# Altium schematic sheet IDC.SchDoc
size A3; DocumentNumber: 9; SheetNumber: 9; SheetTotal: 9
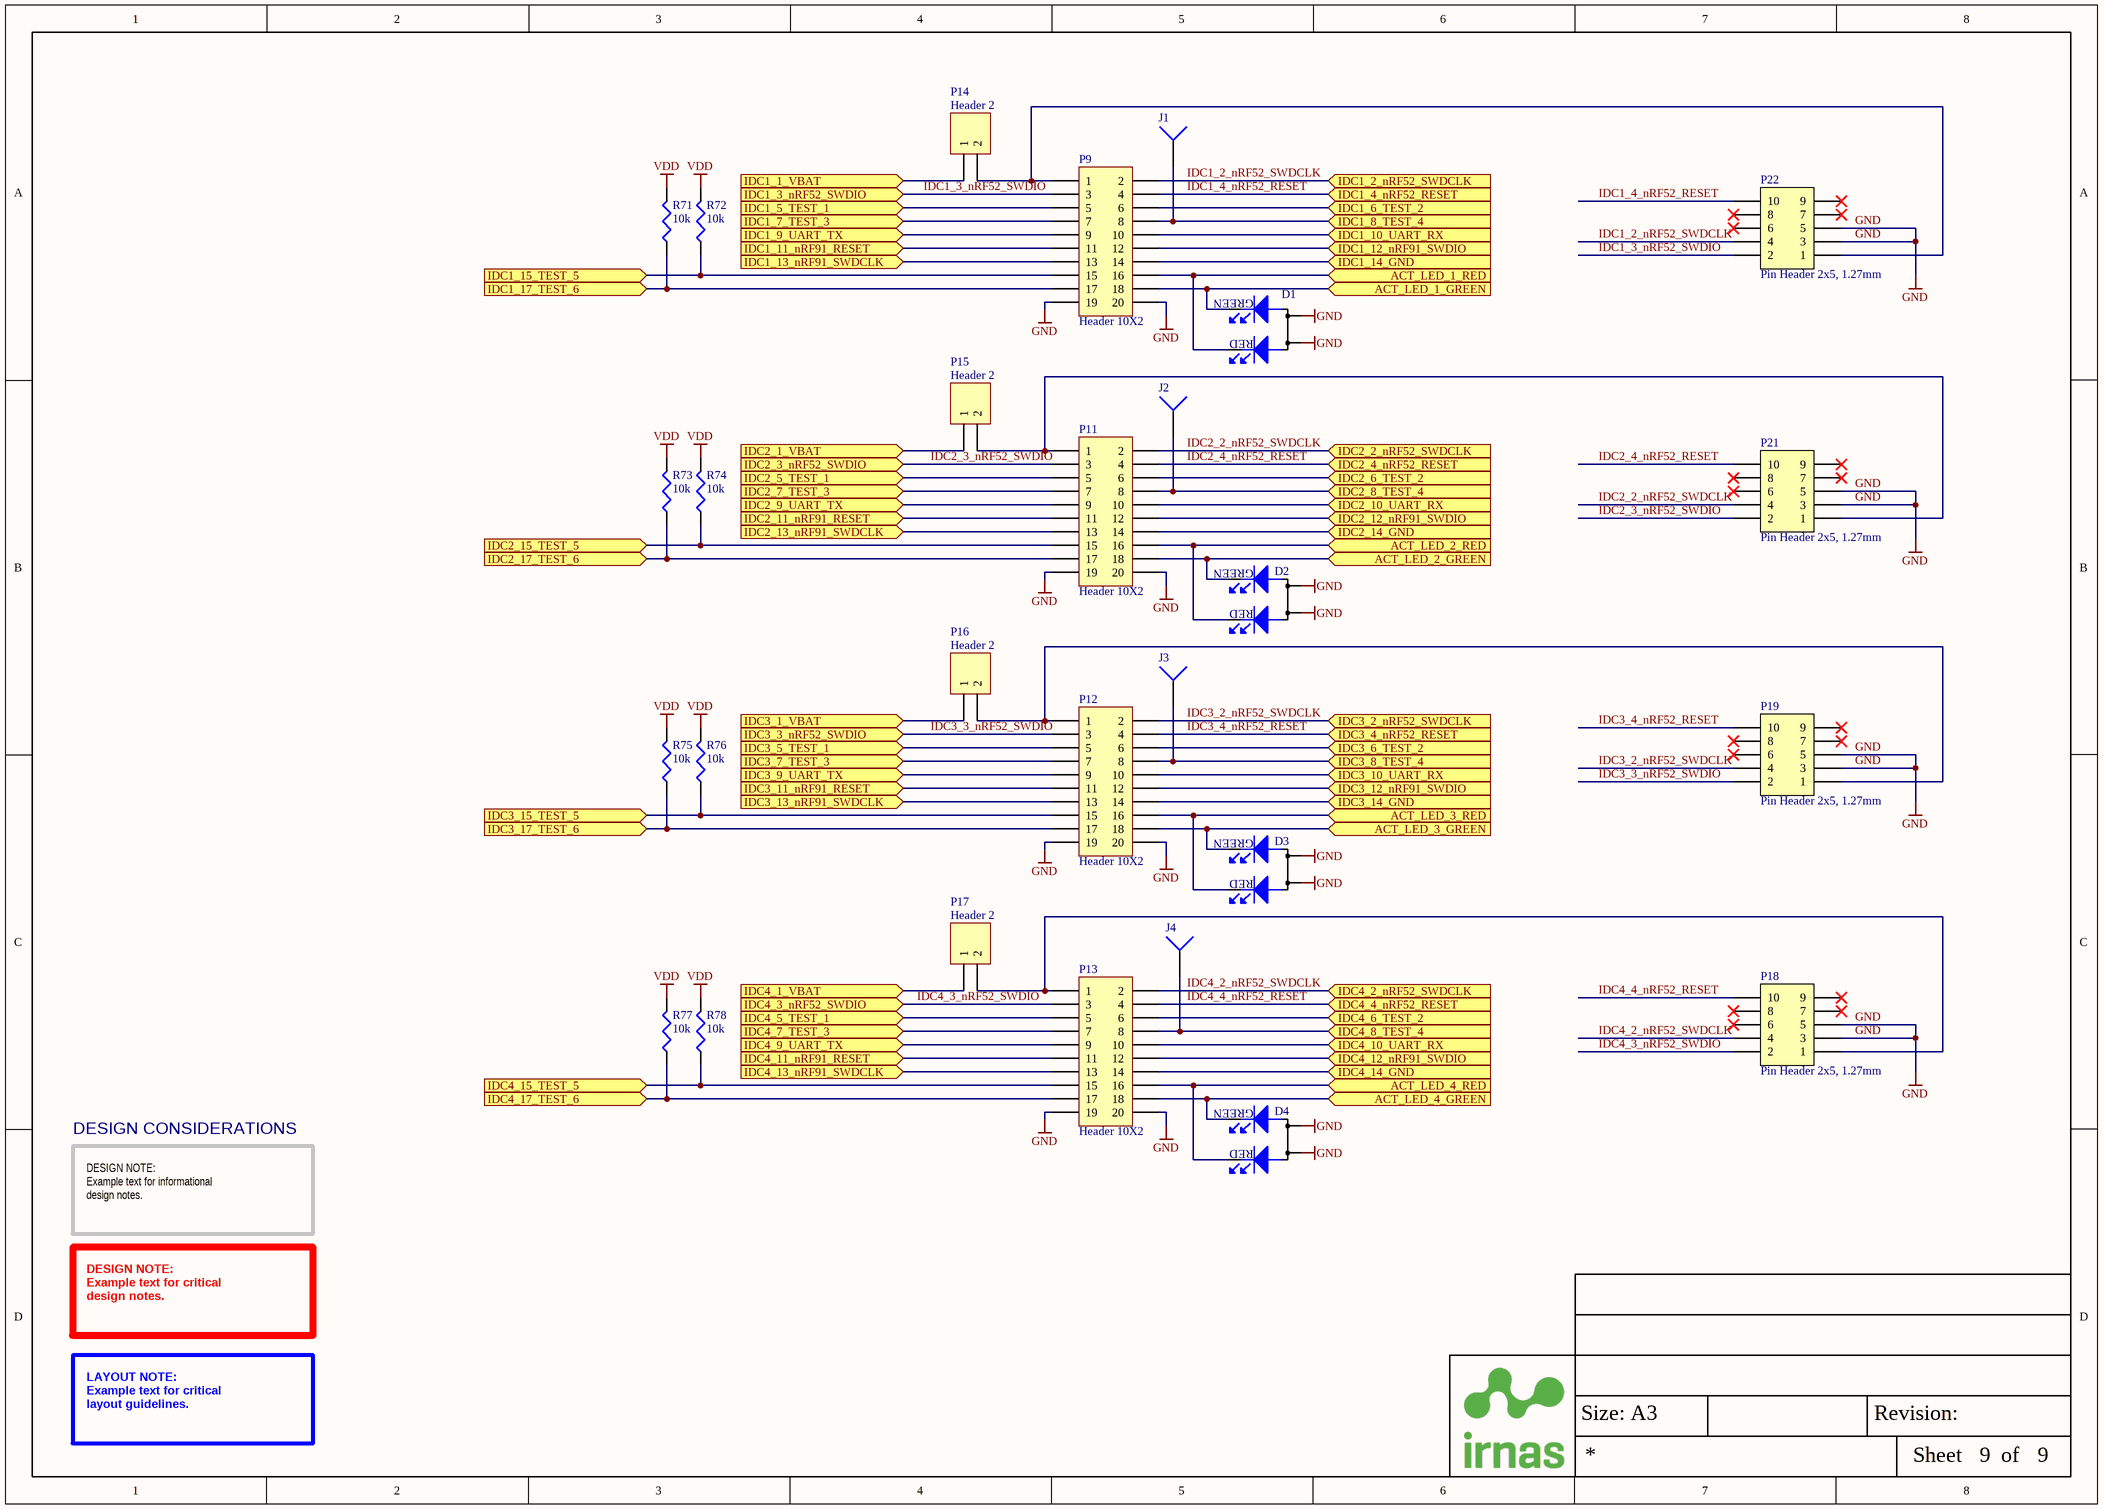
[diagram p0: IDC.SchDoc]

## Parts
D1  KPB-3025ESGC-F01  [LED - 2mm x 2.5mm]  (value not drawn)
D2  KPB-3025ESGC-F01  [LED - 2mm x 2.5mm]  (value not drawn)
D3  KPB-3025ESGC-F01  [LED - 2mm x 2.5mm]  (value not drawn)
D4  KPB-3025ESGC-F01  [LED - 2mm x 2.5mm]  (value not drawn)
J1  Socket  [PIN1]  (value not drawn)
J2  Socket  [PIN1]  (value not drawn)
J3  Socket  [PIN1]  (value not drawn)
J4  Socket  [PIN1]  (value not drawn)
P9  Header 10X2  [HDR2X10]
P11  Header 10X2  [HDR2X10]
P12  Header 10X2  [HDR2X10]
P13  Header 10X2  [HDR2X10]
P14  Header 2  [HDR1X2]
P15  Header 2  [HDR1X2]
P16  Header 2  [HDR1X2]
P17  Header 2  [HDR1X2]
P18  Pin Header 2x5, 1.27mm  [HDR_2x5-SMD-1.27mm-K]
P19  Pin Header 2x5, 1.27mm  [HDR_2x5-SMD-1.27mm-K]
P21  Pin Header 2x5, 1.27mm  [HDR_2x5-SMD-1.27mm-K]
P22  Pin Header 2x5, 1.27mm  [HDR_2x5-SMD-1.27mm-K]
R71  10k  [RES0402]
R72  10k  [RES0402]
R73  10k  [RES0402]
R74  10k  [RES0402]
R75  10k  [RES0402]
R76  10k  [RES0402]
R77  10k  [RES0402]
R78  10k  [RES0402]

## Ports
ACT_LED_1_GREEN (in), ACT_LED_1_RED (in), ACT_LED_2_GREEN (in), ACT_LED_2_RED (in), ACT_LED_3_GREEN (in), ACT_LED_3_RED (in), ACT_LED_4_GREEN (in), ACT_LED_4_RED (in), IDC1_1_VBAT (in), IDC1_2_nRF52_SWDCLK (in), IDC1_3_nRF52_SWDIO (in), IDC1_4_nRF52_RESET (in), IDC1_5_TEST_1 (in), IDC1_6_TEST_2 (in), IDC1_7_TEST_3 (in), IDC1_8_TEST_4 (in), IDC1_9_UART_TX (in), IDC1_10_UART_RX (in), IDC1_11_nRF91_RESET (in), IDC1_12_nRF91_SWDIO (in), IDC1_13_nRF91_SWDCLK (in), IDC1_14_GND (in), IDC1_15_TEST_5 (in), IDC1_17_TEST_6 (in), IDC2_1_VBAT (in), IDC2_2_nRF52_SWDCLK (in), IDC2_3_nRF52_SWDIO (in), IDC2_4_nRF52_RESET (in), IDC2_5_TEST_1 (in), IDC2_6_TEST_2 (in), IDC2_7_TEST_3 (in), IDC2_8_TEST_4 (in), IDC2_9_UART_TX (in), IDC2_10_UART_RX (in), IDC2_11_nRF91_RESET (in), IDC2_12_nRF91_SWDIO (in), IDC2_13_nRF91_SWDCLK (in), IDC2_14_GND (in), IDC2_15_TEST_5 (in), IDC2_17_TEST_6 (in), IDC3_1_VBAT (in), IDC3_2_nRF52_SWDCLK (in), IDC3_3_nRF52_SWDIO (in), IDC3_4_nRF52_RESET (in), IDC3_5_TEST_1 (in), IDC3_6_TEST_2 (in), IDC3_7_TEST_3 (in), IDC3_8_TEST_4 (in), IDC3_9_UART_TX (in), IDC3_10_UART_RX (in), IDC3_11_nRF91_RESET (in), IDC3_12_nRF91_SWDIO (in), IDC3_13_nRF91_SWDCLK (in), IDC3_14_GND (in), IDC3_15_TEST_5 (in), IDC3_17_TEST_6 (in), IDC4_1_VBAT (in), IDC4_2_nRF52_SWDCLK (in), IDC4_3_nRF52_SWDIO (in), IDC4_4_nRF52_RESET (in), IDC4_5_TEST_1 (in), IDC4_6_TEST_2 (in), IDC4_7_TEST_3 (in), IDC4_8_TEST_4 (in), IDC4_9_UART_TX (in), IDC4_10_UART_RX (in), IDC4_11_nRF91_RESET (in), IDC4_12_nRF91_SWDIO (in), IDC4_13_nRF91_SWDCLK (in), IDC4_14_GND (in), IDC4_15_TEST_5 (in), IDC4_17_TEST_6 (in)

## Nets
GND: D1.1(ANODE) D1.3(ANODE) D2.1(ANODE) D2.3(ANODE) D3.1(ANODE) D3.3(ANODE) D4.1(ANODE) D4.3(ANODE) P9.19 P9.20 P11.19 P11.20 P12.19 P12.20 P13.19 P13.20 P18.3 P18.5 P19.3 P19.5 P21.3 P21.5 P22.3 P22.5
VDD: R71.2 R72.2 R73.2 R74.2 R75.2 R76.2 R77.2 R78.2
ACT_LED_1_GREEN: D1.4(cathode) P9.18 ; port ACT_LED_1_GREEN
ACT_LED_1_RED: D1.2(cathode) P9.16 ; port ACT_LED_1_RED
ACT_LED_2_GREEN: D2.4(cathode) P11.18 ; port ACT_LED_2_GREEN
ACT_LED_2_RED: D2.2(cathode) P11.16 ; port ACT_LED_2_RED
ACT_LED_3_GREEN: D3.4(cathode) P12.18 ; port ACT_LED_3_GREEN
ACT_LED_3_RED: D3.2(cathode) P12.16 ; port ACT_LED_3_RED
ACT_LED_4_GREEN: D4.4(cathode) P13.18 ; port ACT_LED_4_GREEN
ACT_LED_4_RED: D4.2(cathode) P13.16 ; port ACT_LED_4_RED
IDC1_1_VBAT: P14.1 ; port IDC1_1_VBAT
IDC1_2_nRF52_SWDCLK: P9.2 P22.4 ; port IDC1_2_nRF52_SWDCLK
IDC1_3_nRF52_SWDIO: P9.3 P22.2 ; port IDC1_3_nRF52_SWDIO
IDC1_4_nRF52_RESET: P9.4 P22.10 ; port IDC1_4_nRF52_RESET
IDC1_5_TEST_1: P9.5 ; port IDC1_5_TEST_1
IDC1_6_TEST_2: P9.6 ; port IDC1_6_TEST_2
IDC1_7_TEST_3: P9.7 ; port IDC1_7_TEST_3
IDC1_8_TEST_4: J1.1 P9.8 ; port IDC1_8_TEST_4
IDC1_9_UART_TX: P9.9 ; port IDC1_9_UART_TX
IDC1_10_UART_RX: P9.10 ; port IDC1_10_UART_RX
IDC1_11_nRF91_RESET: P9.11 ; port IDC1_11_nRF91_RESET
IDC1_12_nRF91_SWDIO: P9.12 ; port IDC1_12_nRF91_SWDIO
IDC1_13_nRF91_SWDCLK: P9.13 ; port IDC1_13_nRF91_SWDCLK
IDC1_14_GND: P9.14 ; port IDC1_14_GND
IDC1_15_TEST_5: P9.15 R72.1 ; port IDC1_15_TEST_5
IDC1_17_TEST_6: P9.17 R71.1 ; port IDC1_17_TEST_6
IDC2_1_VBAT: P15.1 ; port IDC2_1_VBAT
IDC2_2_nRF52_SWDCLK: P11.2 P21.4 ; port IDC2_2_nRF52_SWDCLK
IDC2_3_nRF52_SWDIO: P11.3 P21.2 ; port IDC2_3_nRF52_SWDIO
IDC2_4_nRF52_RESET: P11.4 P21.10 ; port IDC2_4_nRF52_RESET
IDC2_5_TEST_1: P11.5 ; port IDC2_5_TEST_1
IDC2_6_TEST_2: P11.6 ; port IDC2_6_TEST_2
IDC2_7_TEST_3: P11.7 ; port IDC2_7_TEST_3
IDC2_8_TEST_4: J2.1 P11.8 ; port IDC2_8_TEST_4
IDC2_9_UART_TX: P11.9 ; port IDC2_9_UART_TX
IDC2_10_UART_RX: P11.10 ; port IDC2_10_UART_RX
IDC2_11_nRF91_RESET: P11.11 ; port IDC2_11_nRF91_RESET
IDC2_12_nRF91_SWDIO: P11.12 ; port IDC2_12_nRF91_SWDIO
IDC2_13_nRF91_SWDCLK: P11.13 ; port IDC2_13_nRF91_SWDCLK
IDC2_14_GND: P11.14 ; port IDC2_14_GND
IDC2_15_TEST_5: P11.15 R74.1 ; port IDC2_15_TEST_5
IDC2_17_TEST_6: P11.17 R73.1 ; port IDC2_17_TEST_6
IDC3_1_VBAT: P16.1 ; port IDC3_1_VBAT
IDC3_2_nRF52_SWDCLK: P12.2 P19.4 ; port IDC3_2_nRF52_SWDCLK
IDC3_3_nRF52_SWDIO: P12.3 P19.2 ; port IDC3_3_nRF52_SWDIO
IDC3_4_nRF52_RESET: P12.4 P19.10 ; port IDC3_4_nRF52_RESET
IDC3_5_TEST_1: P12.5 ; port IDC3_5_TEST_1
IDC3_6_TEST_2: P12.6 ; port IDC3_6_TEST_2
IDC3_7_TEST_3: P12.7 ; port IDC3_7_TEST_3
IDC3_8_TEST_4: J3.1 P12.8 ; port IDC3_8_TEST_4
IDC3_9_UART_TX: P12.9 ; port IDC3_9_UART_TX
IDC3_10_UART_RX: P12.10 ; port IDC3_10_UART_RX
IDC3_11_nRF91_RESET: P12.11 ; port IDC3_11_nRF91_RESET
IDC3_12_nRF91_SWDIO: P12.12 ; port IDC3_12_nRF91_SWDIO
IDC3_13_nRF91_SWDCLK: P12.13 ; port IDC3_13_nRF91_SWDCLK
IDC3_14_GND: P12.14 ; port IDC3_14_GND
IDC3_15_TEST_5: P12.15 R76.1 ; port IDC3_15_TEST_5
IDC3_17_TEST_6: P12.17 R75.1 ; port IDC3_17_TEST_6
IDC4_1_VBAT: P17.1 ; port IDC4_1_VBAT
IDC4_2_nRF52_SWDCLK: P13.2 P18.4 ; port IDC4_2_nRF52_SWDCLK
IDC4_3_nRF52_SWDIO: P13.3 P18.2 ; port IDC4_3_nRF52_SWDIO
IDC4_4_nRF52_RESET: P13.4 P18.10 ; port IDC4_4_nRF52_RESET
IDC4_5_TEST_1: P13.5 ; port IDC4_5_TEST_1
IDC4_6_TEST_2: P13.6 ; port IDC4_6_TEST_2
IDC4_7_TEST_3: P13.7 ; port IDC4_7_TEST_3
IDC4_8_TEST_4: J4.1 P13.8 ; port IDC4_8_TEST_4
IDC4_9_UART_TX: P13.9 ; port IDC4_9_UART_TX
IDC4_10_UART_RX: P13.10 ; port IDC4_10_UART_RX
IDC4_11_nRF91_RESET: P13.11 ; port IDC4_11_nRF91_RESET
IDC4_12_nRF91_SWDIO: P13.12 ; port IDC4_12_nRF91_SWDIO
IDC4_13_nRF91_SWDCLK: P13.13 ; port IDC4_13_nRF91_SWDCLK
IDC4_14_GND: P13.14 ; port IDC4_14_GND
IDC4_15_TEST_5: P13.15 R78.1 ; port IDC4_15_TEST_5
IDC4_17_TEST_6: P13.17 R77.1 ; port IDC4_17_TEST_6
NetP9_1: P9.1 P14.2 P22.1
NetP11_1: P11.1 P15.2 P21.1
NetP12_1: P12.1 P16.2 P19.1
NetP13_1: P13.1 P17.2 P18.1

Not connected (* = marked no-connect by the designer): P18 6* 7* 8* 9*; P19 6* 7* 8* 9*; P21 6* 7* 8* 9*; P22 6* 7* 8* 9*

## Notes on the sheet
- DESIGN CONSIDERATIONS
- DESIGN NOTE:
  Example text for informational
  design notes.
- DESIGN NOTE:
  Example text for critical
  design notes.
- LAYOUT NOTE:
  Example text for critical
  layout guidelines.
- Size: A3
- Revision:
- Sheet
- of
- (in symbol LED - KPB-3025ESGC-F01) GREEN; RED

## Library data of the parts
D1-D4 = LED - KPB-3025ESGC-F01: LED, Red, Green, SMD, 120 °, Dome, R 20mA, G 20mA; Manufacturer: KINGBRIGHT; Forward Current If: 20; Forward Voltage: 2.1; Wavelength Typ: 626; Luminous Intensity: 10; Viewing Angle: 170°; Lens Shape: Rectangular; SVHC: No SVHC (17-Dec-2015)<!--FANDB--><div class="features-and-benefits-container"><div class="features-and-benefits-description"><span class="features-benefits-value">The HSMS-C190 is a HER SMD Chip LED with untinted/diffused lens, made of GaP. It is designed in an industry standard package 1.6 x 0.8mm footprint with 0.8mm profile. It is compatible with IR reflow solder processes. The small size and wide viewing angle make this LED prime choices for backlighting applications and front panel illumination especially where space is a premium.</span></div><div class="features-and-benefits-list"><ul class="features-and-benefits-list-list"><li class="features-and-benefits-list-item">Small size</li><li class="features-and-benefits-list-item">Industry standard footprint</li><li class="features-and-benefits-list-item">Compatible with IR solder</li><li class="features-and-benefits-list-item">Diffused optics</li><li class="features-and-benefits-list-item">-40 to 85; Manufacturer Part Number: KPB-3025ESGC-F01; RoHS: YES; Stock 1: 7534; Pricing 1: 1=0.361, 10=0.256, 50=0.235, 100=0.106, 200=0.101 (GBP); LED Colour: Red; LED Mounting: SMD; Bulb Size: -; Packaging: Cut Tape; Product Range: -; Automotive Qualification Standard: -; MSL: -; Supplier 1: Farnell; Supplier Part Number 1: 8530173
P9 P11-P13 = Header 10X2: Header, 10-Pin, Dual row; LatestRevisionDate: 17-Jul-2002; LatestRevisionNote: Re-released for DXP Platform.; Publisher: Altium Limited
P14-P17 = Header 2: Header, 2-Pin; LatestRevisionDate: 17-Jul-2002; LatestRevisionNote: Re-released for DXP Platform.; Publisher: Altium Limited
P18 P19 P21 P22 = CONN-2x5: Pin Header 2x5, 1.27mm (50mil), SMD, Keying Shroud; Part Number: Pin Header 2x5 SMD, 1.27mm, KS; Manufacturer: W-CON; Manufacturer Part Number: 3132-10MS0BK00R1; Part number IPS: 00000009968; Artikkelnr Noca: 55010009; Footprint Doc: HDR_2x5-SMD-1.27mm; LatestRevisionDate: 2016-04-21; Pin Count: 10; Publisher: Nordic Semiconductor; Published: 2016-01-22; Value: Pin Header 2x5, 1.27mm; Note: *; ComponentLink1URL: *; ComponentLink1Description: Datasheet; ComponentLink2URL: *; ComponentLink2Description: Supplier link; HelpURL: \\hizz\pro\app9717\Datasheet\connectores\W-CON\3132-XXMXXBK00XX.pdf; Supplier 1: Cabcon; Supplier Part Number 1: 3132-10MS0BK00R1; Supplier 2: Samtec; Supplier Part Number 2: FTSH-105-01-F-DV-K
R71-R78 = R - 10k/0402: MULTICOMP         MCWR04X1002FTL             SMD Chip Resistor, Thick Film, 10 kohm, 50 V, 0402 [1005 Metric], 62.5 mW,  1%, MCWR Series; IRNAS Part No.: I-100014; Resistance: 10kR; Voltage Rating: 50V; Power Rating: 62.5mW; Temperature Coefficient: 100ppm/°C; Supplier 1: Farnell; Manufacturer: Multicomp; Manufacturer Part Number: MCWR04X1002FTL; Stock 1: 602609; Pricing 1: 10=0.0029, 100=0.0017, 500=0.0012, 2500=0.001, 5000=0.0008 (EUR); Case/Package: 0402; Case Code (Metric): 1005; Case Code (Imperial): 0402; Packaging: Cut Tape; Composition: Thick Film; Tolerance: 1%; Voltage Rating (DC): 50V; REACH SVHC: No SVHC; ComponentLink1URL: http://www.farnell.com/datasheets/1849611.pdf; ComponentLink1Description: http://www.farnell.com/datasheets/1849611.pdf; Supplier Part Number 1: 2447096
J1-J4 = Socket: LatestRevisionDate: 17-Jul-2002; LatestRevisionNote: Re-released for DXP Platform.; Publisher: Altium Limited